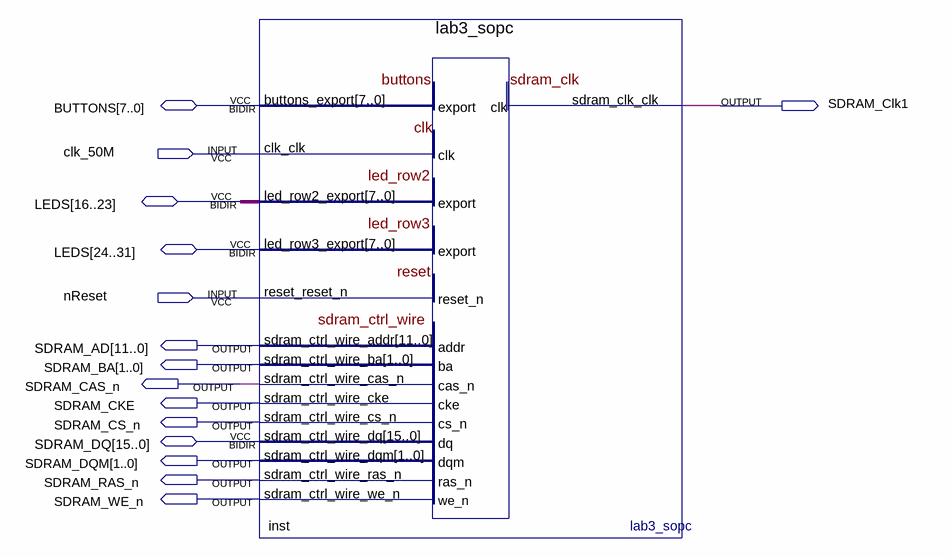
[diagram p0: schematic sheet]
// Quartus schematic lab3.bdf as structural Verilog: 1 symbols, 15 pins
module lab3 (
  input  clk_50M,
  input  nReset,
  inout  [7:0] BUTTONS,
  inout  [16:31] LEDS,
  inout  [15:0] SDRAM_DQ,
  output SDRAM_Clk1,
  output [11:0] SDRAM_AD,
  output [1:0] SDRAM_BA,
  output SDRAM_CAS_n,
  output SDRAM_CKE,
  output SDRAM_CS_n,
  output [1:0] SDRAM_DQM,
  output SDRAM_RAS_n,
  output SDRAM_WE_n
);

  lab3_sopc inst (
    .clk_clk(clk_50M), .reset_reset_n(nReset), .sdram_clk_clk(SDRAM_Clk1), .sdram_ctrl_wire_addr(SDRAM_AD),
    .sdram_ctrl_wire_ba(SDRAM_BA), .sdram_ctrl_wire_cas_n(SDRAM_CAS_n), .sdram_ctrl_wire_cke(SDRAM_CKE),
    .sdram_ctrl_wire_cs_n(SDRAM_CS_n), .sdram_ctrl_wire_dqm(SDRAM_DQM), .sdram_ctrl_wire_ras_n(SDRAM_RAS_n),
    .sdram_ctrl_wire_we_n(SDRAM_WE_n), .buttons_export(BUTTONS), .led_row2_export(LEDS[16:23]),
    .led_row3_export(LEDS[24:31]), .sdram_ctrl_wire_dq(SDRAM_DQ));
endmodule
